# Altium project GEN8 SAS Convert.PrjPcb
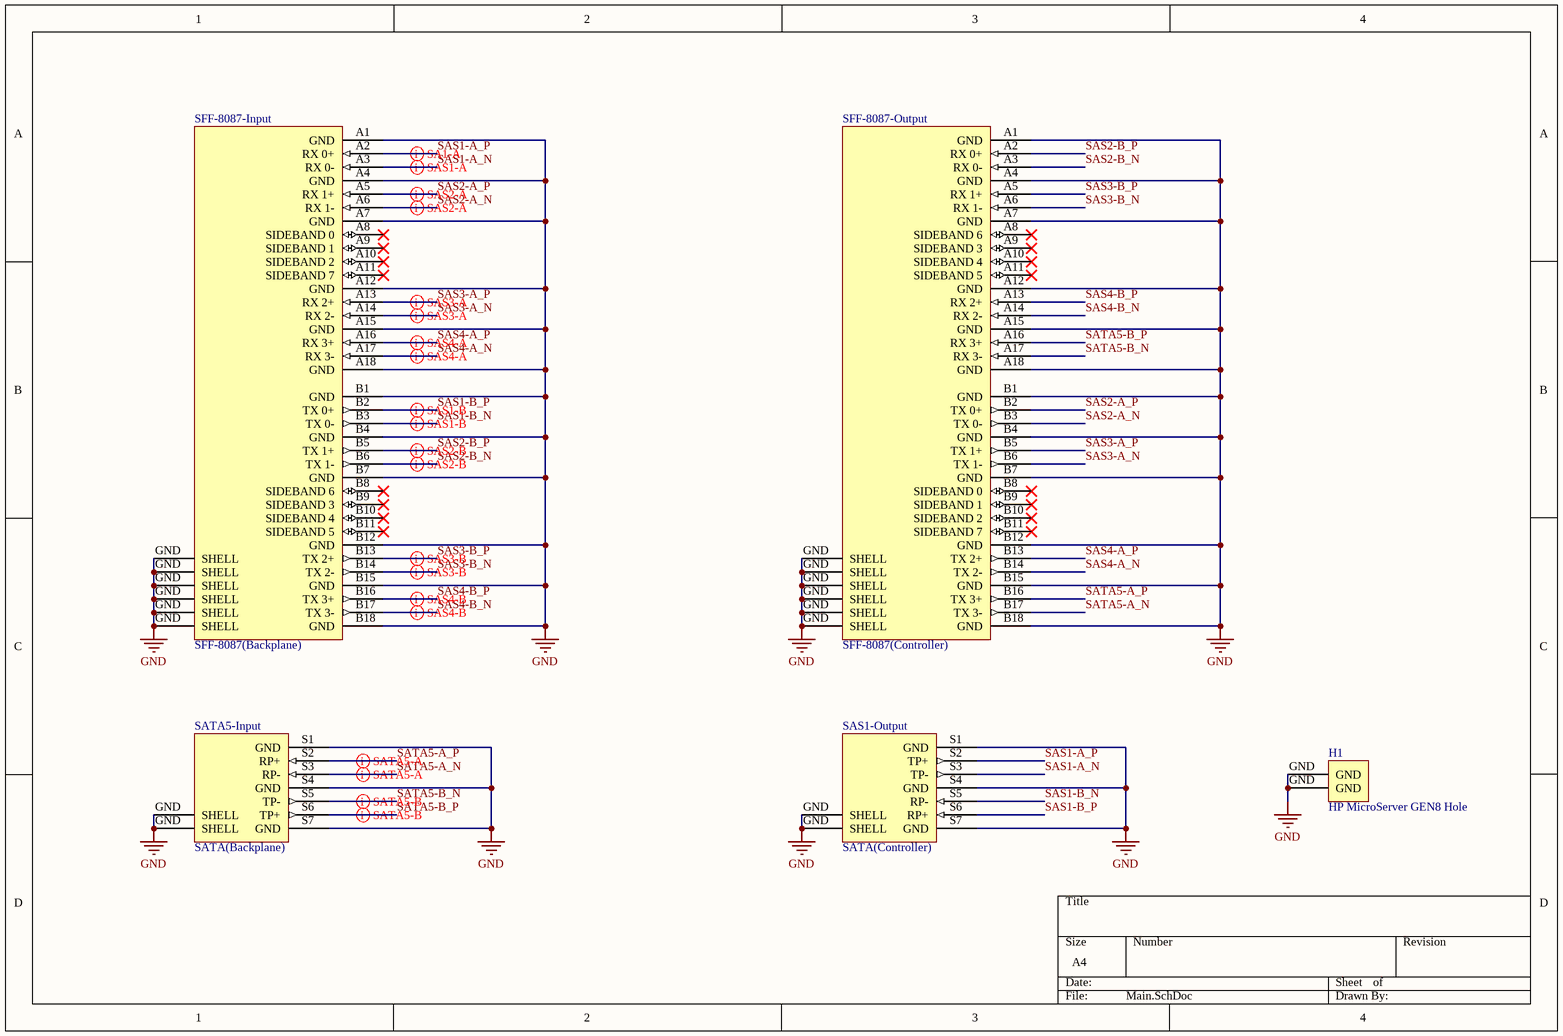
[diagram p0: Main.SchDoc]
1 sheet, 5 parts. Net scope: global (net labels, ports and power ports of the same name join across sheets).
Board file: Main.PcbDoc

## Sheet Main.SchDoc: GEN8 SAS Convert
size A4

### Parts
H1  HP MicroServer GEN8 Hole  [GEN8-HDD-Backplane-Hole]
SAS1-Output  SATA(Controller)  [MOLEX SATA (47080-4001)]
SATA5-Input  SATA(Backplane)  [MOLEX SATA (47080-4001)]
SFF-8087-Input  SFF-8087(Backplane)  [Molex SFF-8087 (75783-0140)]
SFF-8087-Output  SFF-8087(Controller)  [Molex SFF-8087 (75783-0140)]

### Nets
GND: H1.GND SAS1-Output.GND(SHELL) SAS1-Output.S1(GND) SAS1-Output.S4(GND) SAS1-Output.S7(GND) SATA5-Input.GND(SHELL) SATA5-Input.S1(GND) SATA5-Input.S4(GND) SATA5-Input.S7(GND) SFF-8087-Input.A1(GND) SFF-8087-Input.A4(GND) SFF-8087-Input.A7(GND) SFF-8087-Input.A12(GND) SFF-8087-Input.A15(GND) SFF-8087-Input.A18(GND) SFF-8087-Input.B1(GND) SFF-8087-Input.B4(GND) SFF-8087-Input.B7(GND) SFF-8087-Input.B12(GND) SFF-8087-Input.B15(GND) SFF-8087-Input.B18(GND) SFF-8087-Input.GND(SHELL) SFF-8087-Output.A1(GND) SFF-8087-Output.A4(GND) SFF-8087-Output.A7(GND) SFF-8087-Output.A12(GND) SFF-8087-Output.A15(GND) SFF-8087-Output.A18(GND) SFF-8087-Output.B1(GND) SFF-8087-Output.B4(GND) SFF-8087-Output.B7(GND) SFF-8087-Output.B12(GND) SFF-8087-Output.B15(GND) SFF-8087-Output.B18(GND) SFF-8087-Output.GND(SHELL)
SAS1-A_N: SAS1-Output.S3(TP-) SFF-8087-Input.A3(RX_0-)
SAS1-A_P: SAS1-Output.S2(TP+) SFF-8087-Input.A2(RX_0+)
SAS1-B_N: SAS1-Output.S5(RP-) SFF-8087-Input.B3(TX_0-)
SAS1-B_P: SAS1-Output.S6(RP+) SFF-8087-Input.B2(TX_0+)
SAS2-A_N: SFF-8087-Input.A6(RX_1-) SFF-8087-Output.B3(TX_0-)
SAS2-A_P: SFF-8087-Input.A5(RX_1+) SFF-8087-Output.B2(TX_0+)
SAS2-B_N: SFF-8087-Input.B6(TX_1-) SFF-8087-Output.A3(RX_0-)
SAS2-B_P: SFF-8087-Input.B5(TX_1+) SFF-8087-Output.A2(RX_0+)
SAS3-A_N: SFF-8087-Input.A14(RX_2-) SFF-8087-Output.B6(TX_1-)
SAS3-A_P: SFF-8087-Input.A13(RX_2+) SFF-8087-Output.B5(TX_1+)
SAS3-B_N: SFF-8087-Input.B14(TX_2-) SFF-8087-Output.A6(RX_1-)
SAS3-B_P: SFF-8087-Input.B13(TX_2+) SFF-8087-Output.A5(RX_1+)
SAS4-A_N: SFF-8087-Input.A17(RX_3-) SFF-8087-Output.B14(TX_2-)
SAS4-A_P: SFF-8087-Input.A16(RX_3+) SFF-8087-Output.B13(TX_2+)
SAS4-B_N: SFF-8087-Input.B17(TX_3-) SFF-8087-Output.A14(RX_2-)
SAS4-B_P: SFF-8087-Input.B16(TX_3+) SFF-8087-Output.A13(RX_2+)
SATA5-A_N: SATA5-Input.S3(RP-) SFF-8087-Output.B17(TX_3-)
SATA5-A_P: SATA5-Input.S2(RP+) SFF-8087-Output.B16(TX_3+)
SATA5-B_N: SATA5-Input.S5(TP-) SFF-8087-Output.A17(RX_3-)
SATA5-B_P: SATA5-Input.S6(TP+) SFF-8087-Output.A16(RX_3+)

Not connected (* = marked no-connect by the designer): SFF-8087-Input A8(SIDEBAND_0)* A9(SIDEBAND_1)* A10(SIDEBAND_2)* A11(SIDEBAND_7)* B8(SIDEBAND_6)* B9(SIDEBAND_3)* B10(SIDEBAND_4)* B11(SIDEBAND_5)*; SFF-8087-Output A8(SIDEBAND_6)* A9(SIDEBAND_3)* A10(SIDEBAND_4)* A11(SIDEBAND_5)* B8(SIDEBAND_0)* B9(SIDEBAND_1)* B10(SIDEBAND_2)* B11(SIDEBAND_7)*

### Layout directives
differential pair: SAS1-A_N, SAS1-A_P, SAS1-B_N, SAS1-B_P, SAS2-A_N, SAS2-A_P, SAS2-B_N, SAS2-B_P, SAS3-A_N, SAS3-A_P, SAS3-B_N, SAS3-B_P, SAS4-A_N, SAS4-A_P, SAS4-B_N, SAS4-B_P, SATA5-A_N, SATA5-A_P, SATA5-B_N, SATA5-B_P